# Altium schematic sheet DAC.SchDoc
size A4; SheetNumber: 4; SheetTotal: 6
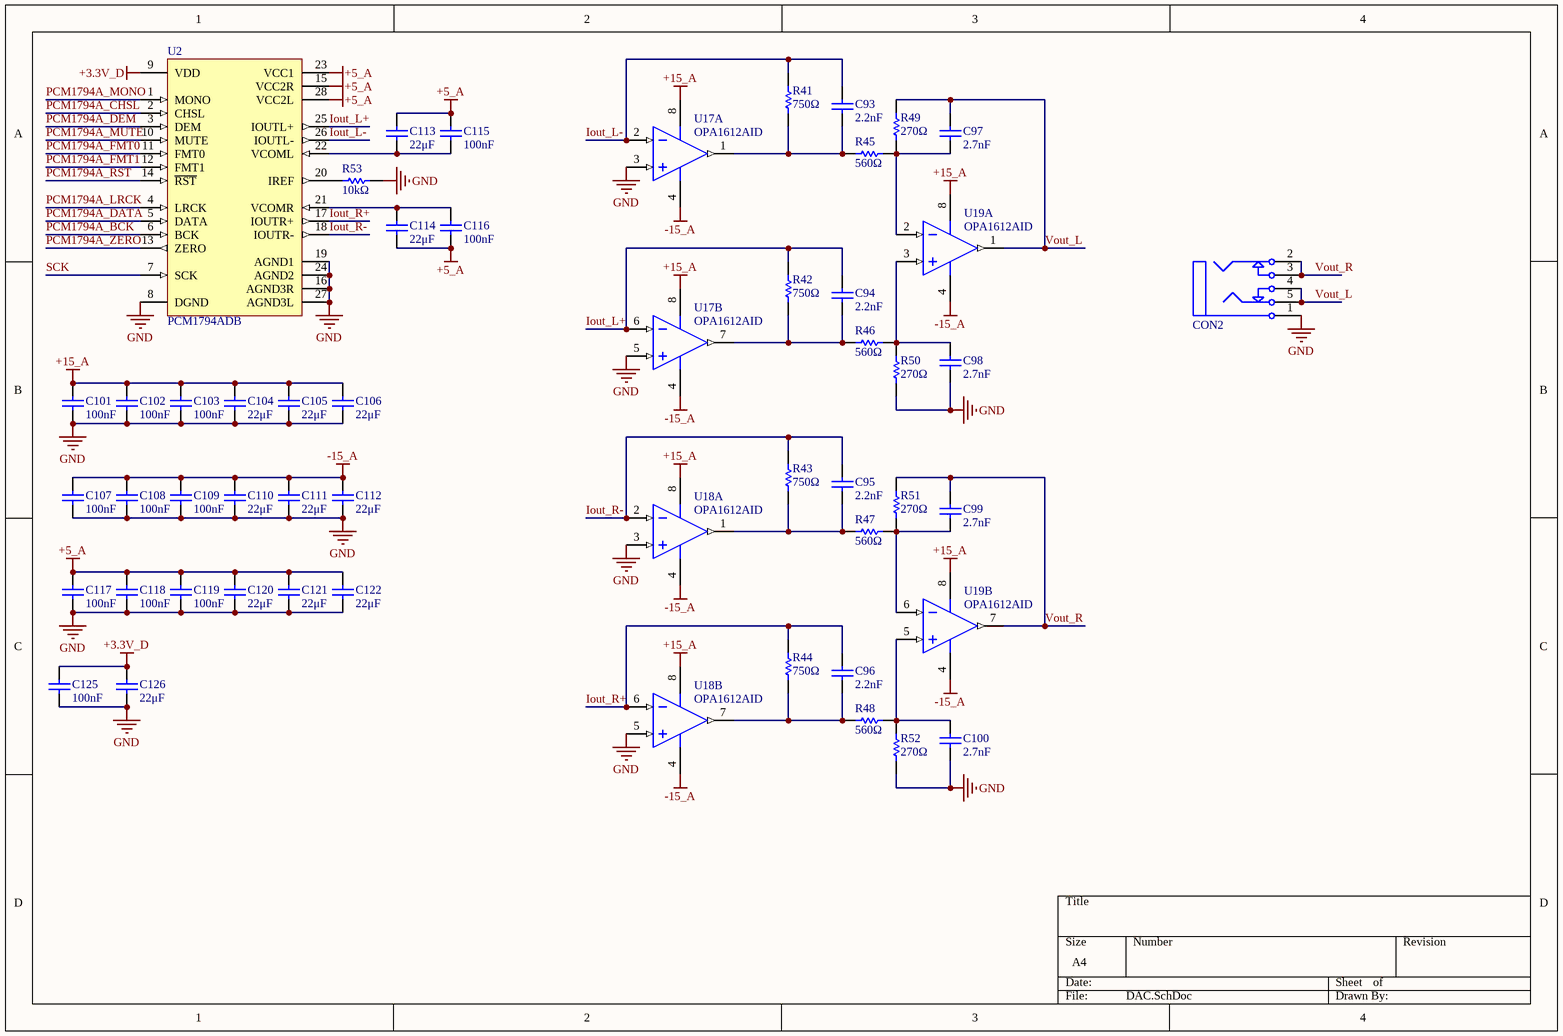
[diagram p0: DAC.SchDoc]

## Parts
C93  2.2nF  [C 0402_L]
C94  2.2nF  [C 0402_L]
C95  2.2nF  [C 0402_L]
C96  2.2nF  [C 0402_L]
C97  2.7nF  [C 0402_L]
C98  2.7nF  [C 0402_L]
C99  2.7nF  [C 0402_L]
C100  2.7nF  [C 0402_L]
C101  100nF  [C 0402_L]
C102  100nF  [C 0402_L]
C103  100nF  [C 0402_L]
C104  22μF  [0805_C]
C105  22μF  [0805_C]
C106  22μF  [0805_C]
C107  100nF  [C 0402_L]
C108  100nF  [C 0402_L]
C109  100nF  [C 0402_L]
C110  22μF  [0805_C]
C111  22μF  [0805_C]
C112  22μF  [0805_C]
C113  22μF  [0805_C]
C114  22μF  [0805_C]
C115  100nF  [C 0402_L]
C116  100nF  [C 0402_L]
C117  100nF  [C 0402_L]
C118  100nF  [C 0402_L]
C119  100nF  [C 0402_L]
C120  22μF  [0805_C]
C121  22μF  [0805_C]
C122  22μF  [0805_C]
C125  100nF  [C 0402_L]
C126  22μF  [0805_C]
CON2  3F07_BK  [3F07_PK]  (value not drawn)
R41  750Ω  [R 0402_L]
R42  750Ω  [R 0402_L]
R43  750Ω  [R 0402_L]
R44  750Ω  [R 0402_L]
R45  560Ω  [R 0402_L]
R46  560Ω  [R 0402_L]
R47  560Ω  [R 0402_L]
R48  560Ω  [R 0402_L]
R49  270Ω  [R 0402_L]
R50  270Ω  [R 0402_L]
R51  270Ω  [R 0402_L]
R52  270Ω  [R 0402_L]
R53  10kΩ  [R 0402_L]
U2  PCM1794ADB  [SOP65P780X200-28N]
U17  OPA1612AID  [D0008A_L]  (parts A,B of 2)
U18  OPA1612AID  [D0008A_L]  (parts A,B of 2)
U19  OPA1612AID  [D0008A_L]  (parts A,B of 2)

## Nets
+3.3V_D: C125.1 C126.1 U2.9(VDD)
+5_A: C113.1 C114.2 C115.1 C116.2 C117.1 C118.1 C119.1 C120.1 C121.1 C122.1 U2.15(VCC2R) U2.23(VCC1) U2.28(VCC2L)
+15_A: C101.1 C102.1 C103.1 C104.1 C105.1 C106.1 U17.8(V+) U18.8(V+) U19.8(V+)
-15_A: C107.1 C108.1 C109.1 C110.1 C111.1 C112.1 U17.4(V-) U18.4(V-) U19.4(V-)
GND: C98.2 C100.2 C101.2 C102.2 C103.2 C104.2 C105.2 C106.2 C107.2 C108.2 C109.2 C110.2 C111.2 C112.2 C117.2 C118.2 C119.2 C120.2 C121.2 C122.2 C125.2 C126.2 CON2.1 R50.1 R52.1 R53.1 U2.8(DGND) U2.16(AGND3R) U2.19(AGND1) U2.24(AGND2) U2.27(AGND3L) U17.3(IN_A+) U17.5(IN_B+) U18.3(IN_A+) U18.5(IN_B+)
Iout_L+: C94.1 R42.1 U2.25(IOUTL+) U17.6(IN_B-)
Iout_L-: C93.1 R41.1 U2.26(IOUTL-) U17.2(IN_A-)
Iout_R+: C96.1 R44.1 U2.17(IOUTR+) U18.6(IN_B-)
Iout_R-: C95.1 R43.1 U2.18(IOUTR-) U18.2(IN_A-)
PCM1794A_BCK: U2.6(BCK)
PCM1794A_CHSL: U2.2(CHSL)
PCM1794A_DATA: U2.5(DATA)
PCM1794A_DEM: U2.3(DEM)
PCM1794A_FMT0: U2.11(FMT0)
PCM1794A_FMT1: U2.12(FMT1)
PCM1794A_LRCK: U2.4(LRCK)
PCM1794A_MONO: U2.1(MONO)
PCM1794A_MUTE: U2.10(MUTE)
PCM1794A_~{RST}: U2.14(~{RST})
PCM1794A_ZERO: U2.13(ZERO)
SCK: U2.7(SCK)
Vout_L: C97.1 CON2.4 CON2.5 R49.2 U19.1(OUT_A)
Vout_R: C99.1 CON2.2 CON2.3 R51.2 U19.7(OUT_B)
NetC93_2: C93.2 R41.2 R45.1 U17.1(OUT_A)
NetC94_2: C94.2 R42.2 R46.1 U17.7(OUT_B)
NetC95_2: C95.2 R43.2 R47.1 U18.1(OUT_A)
NetC96_2: C96.2 R44.2 R48.1 U18.7(OUT_B)
NetC97_2: C97.2 R45.2 R49.1 U19.2(IN_A-)
NetC98_1: C98.1 R46.2 R50.2 U19.3(IN_A+)
NetC99_2: C99.2 R47.2 R51.1 U19.6(IN_B-)
NetC100_1: C100.1 R48.2 R52.2 U19.5(IN_B+)
NetC113_2: C113.2 C115.2 U2.22(VCOML)
NetC114_1: C114.1 C116.1 U2.21(VCOMR)
NetR53_2: R53.2 U2.20(IREF)

## Library data of the parts
C93-C122 C125 C126 = Cap: Capacitor; Value: 10uF; Published: 8-Jun-2000; LatestRevisionDate: 17-Jul-2002; LatestRevisionNote: Re-released for DXP Platform.; PackageReference: RAD-0.3; Publisher: Altium Limited; PackageDescription: Radial Cap, Thru-Hole; 2 Leads; 0.3 in Pin Spacing
CON2 = 3F07: 3.5mm耳机插座; 淘宝ID: 小糖豆的小窝窝; BOM名称: 3.5mm耳机插座; 下单链接: https://item.taobao.com/item.htm?ft=t&id=613637044352
R41-R53 = Res1: Resistor; Value: 43K; Published: 8-Jun-2000; LatestRevisionDate: 17-Jul-2002; LatestRevisionNote: Re-released for DXP Platform.; PackageReference: AXIAL-0.3; Publisher: Altium Limited; PackageDescription: Axial Device, Thru-Hole; 2 Leads; 0.3 in Pin Spacing
U2 = PCM1794ADB: 132dB SNR Highest Performance Stereo DAC (H/W Control) 28-SSOP -25 to 85; MF: Texas Instruments; Purchase-URL: https://pricing.snapeda.com/search/part/PCM1794ADB/?ref=eda; MP: PCM1794ADB; Value: *; SnapEDA_Link: https://www.snapeda.com/parts/PCM1794ADB/Texas%20Instruments/view-part/371602/?ref=snap; Check_prices: https://www.snapeda.com/parts/PCM1794ADB/Texas%20Instruments/view-part/371602/?ref=eda; Availability: Warning; Price: None; Package: SSOP-28 Texas Instruments
U17-U19 = CMP-0808-00013-2: 1.1 nV/rtHz Noise, Low Power, Precision Operational Amplifier, 4.5 to 36 V, -40 to 85 degC, 8-pin SOIC (D8), Green (RoHS & no Sb/Br); Manufacturer: Texas Instruments; Number of Channels: 2; Vmin(V): 4.5; Vmax(V): 36; SubFamily: Audio Operational Amplifier; Vn at Flatband(Typ)(nV/rtHz): 1.1; GBW(Typ)(MHz): 40; ComponentLink3URL: http://www.ti.com/litv/pdf/msoi002j; ComponentLink3Description: Package Specification; PartNumber: OPA1612AID; PackageVersion: 4040047-3/M, 06/2011; Code_JEDEC: MS-012; Eco-Plan: Green (RoHS & no Sb/Br); PackageReference: D0008A; ComponentLink1Description: Manufacturer URL; ComponentLink2URL: http://www.ti.com/general/docs/lit/getliterature.tsp?genericPartNumber=OPA1612&fileType=pdf; DatasheetVersion: SBOS450B; ComponentLink1URL: http://www.ti.com/; PackageDescription: 8-Pin Plastic Small Outline, Body 4.9 x 3.9 mm, Pitch 1.27 mm; Iq per channel(Max)(mA): 4.5; Mounting Technology: Surface Mount; ComponentLink2Description: Datasheet